# EAGLE design pactec_version_rev_A (EAGLE 6.6.0)
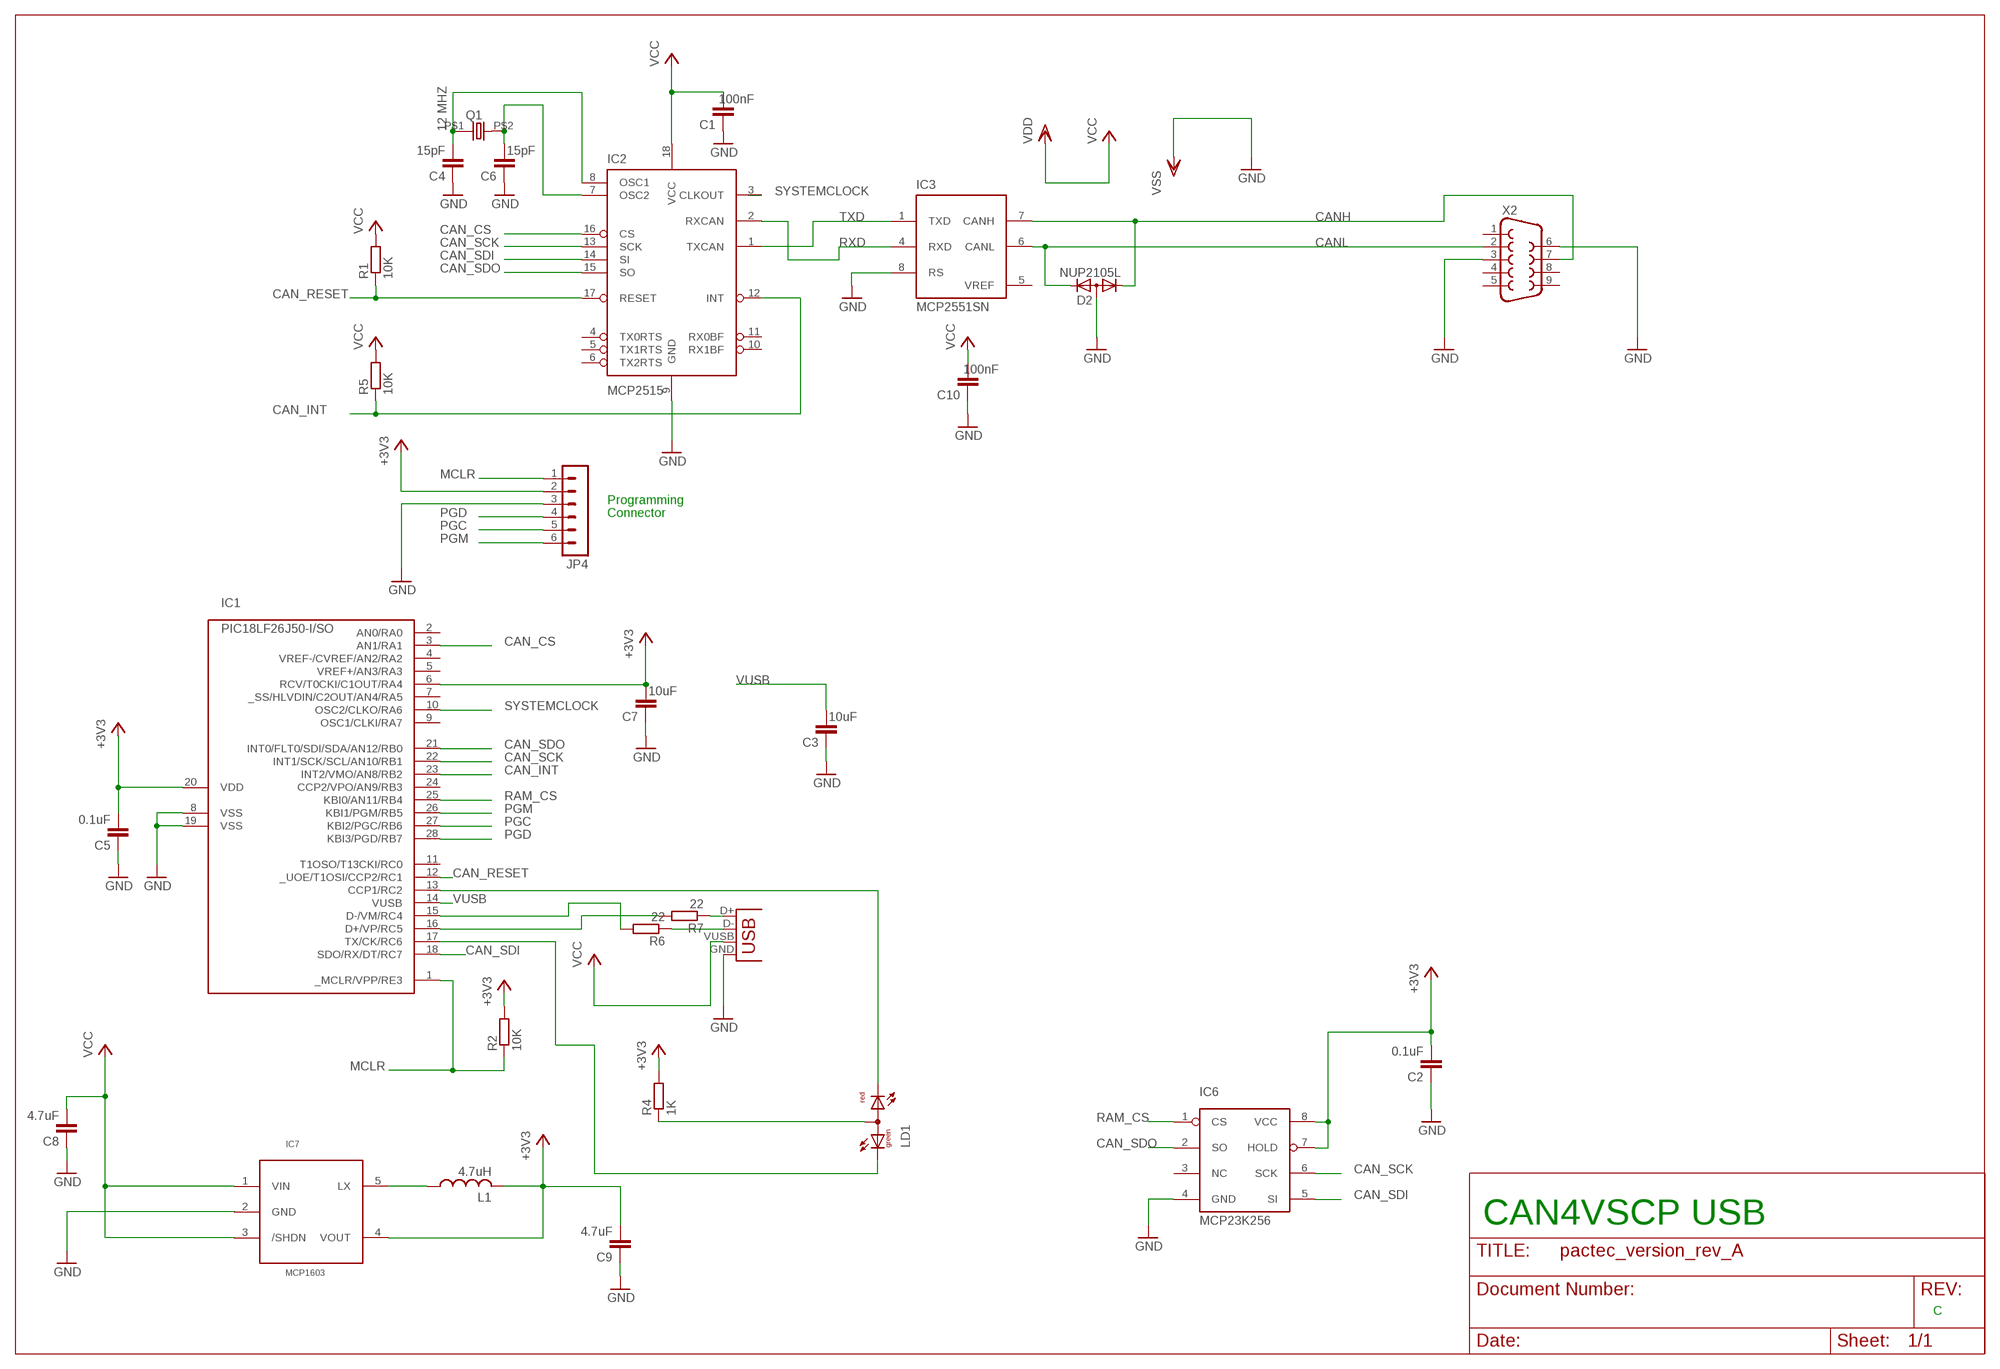
[diagram p0: schematic, sheet 1]

## Parts
C1  100nF  C-EUC0805  [C0805]
C2  0.1uF  C-EUC0805  [C0805]
C3  10uF  C-EUC0805  [C0805]
C4  15pF  C-EUC0805  [C0805]
C5  0.1uF  C-EUC0805  [C0805]
C6  15pF  C-EUC0805  [C0805]
C7  10uF  C-EUC0805  [C0805]
C8  4.7uF  C-EUC0805  [C0805]
C9  4.7uF  C-EUC0805  [C0805]
C10  100nF  C-EUC0805  [C0805]
D2  NUP2105L  DIODE-2CA|ACSOT23  [SOT23]
IC1  PIC18LF26J50-I/SO  PIC18LF2550-I/SO  [SO-28W]
IC2  MCP2515  [SO-18W]
IC3  MCP2551SN  [SO-08]
IC6  MCP23K256  MCP23A256  [SO-8]
IC7  MCP1603  [SOT23-5L]
J4  USB-B-S  [USB-B-SMT]
JP4  MA06-1  [MA06-1]
L1  4.7uH  L-USL2012C  [L2012C]
LD1  DUOLED-RG-A  [DUOLED-A-5MM]
Q1  12 MHZ  HC-49S  [9C]
R1  10K  R-EU_R0805  [R0805]
R2  10K  R-EU_R0805  [R0805]
R4  1K  R-EU_R0805  [R0805]
R5  10K  R-EU_R0805  [R0805]
R6  22  R-EU_R0805  [R0805]
R7  22  R-EU_R0805  [R0805]
X2  DB9MALE  [DB9_MALE]

## Nets
+3V3: C2.2 C5.2 C7.2 C9.2 IC1.6(RCV/T0CKI/C1OUT/RA4) IC1.20(VDD) IC6.7(HOLD) IC6.8(VCC) IC7.4(VOUT) JP4.2 L1.2 R2.2 R4.2
CAN_CS: IC1.3(AN1/RA1) IC2.16(CS)
CAN_INT: IC1.23(INT2/VMO/AN8/RB2) IC2.12(INT) R5.1
CAN_RESET: IC1.12(_UOE/T1OSI/CCP2/RC1) IC2.17(RESET) R1.1
CAN_SCK: IC1.22(INT1/SCK/SCL/AN10/RB1) IC2.13(SCK) IC6.6(SCK)
CAN_SDI: IC1.18(SDO/RX/DT/RC7) IC2.14(SI) IC6.5(SI)
CAN_SDO: IC1.21(INT0/FLT0/SDI/SDA/AN12/RB0) IC2.15(SO) IC6.2(SO)
CANH: D2.1(K1) IC3.7(CANH) X2.7
CANL: D2.2(K2) IC3.6(CANL) X2.2
GND: C1.1 C2.1 C3.1 C4.1 C5.1 C6.1 C7.1 C8.1 C9.1 C10.1 D2.3(A) IC1.8(VSS) IC1.19(VSS) IC2.9(GND) IC3.8(RS) IC6.4(GND) IC7.2(GND) J4.GND JP4.3 X2.3 X2.6 ; supply symbol labelled VSS
MCLR: IC1.1(_MCLR/VPP/RE3) JP4.1 R2.1
N$1: IC1.16(D+/VP/RC5) R7.2
N$2: C4.2 IC2.8(OSC1) Q1.P$1
N$3: IC1.15(D-/VM/RC4) R6.2
N$4: LD1.A R4.1
N$5: IC1.13(CCP1/RC2) LD1.CR
N$7: C6.2 IC2.7(OSC2) Q1.P$2
N$10: IC1.17(TX/CK/RC6) LD1.CX(CG)
N$13: J4.D- R6.1
N$14: J4.D+ R7.1
N$16: IC7.5(LX) L1.1
PGC: IC1.27(KBI2/PGC/RB6) JP4.5
PGD: IC1.28(KBI3/PGD/RB7) JP4.4
PGM: IC1.26(KBI1/PGM/RB5) JP4.6
RAM_CS: IC1.25(KBI0/AN11/RB4) IC6.1(CS)
RXD: IC2.2(RXCAN) IC3.4(RXD)
SYSTEMCLOCK: IC1.10(OSC2/CLKO/RA6) IC2.3(CLKOUT)
TXD: IC2.1(TXCAN) IC3.1(TXD)
VCC: C1.2 C8.2 C10.2 IC2.18(VCC) IC7.1(VIN) IC7.3(/SHDN) J4.VUSB(VBUS) R1.2 R5.2 ; supply symbol labelled VDD
VUSB: C3.2 IC1.14(VUSB)
Unconnected: IC1.2(AN0/RA0) IC1.4(VREF-/CVREF/AN2/RA2) IC1.5(VREF+/AN3/RA3) IC1.7(_SS/HLVDIN/C2OUT/AN4/RA5) IC1.9(OSC1/CLKI/RA7) IC1.11(T1OSO/T13CKI/RC0) IC1.24(CCP2/VPO/AN9/RB3) IC2.4(TX0RTS) IC2.5(TX1RTS) IC2.6(TX2RTS) IC2.10(RX1BF) IC2.11(RX0BF) IC6.3(NC) X2.1 X2.4 X2.5 X2.8 X2.9

## Notes on the sheet
- Programming
- Connector
- CAN4VSCP USB
- C

## Power pins joined to a net without a drawn wire
GND: IC3.2(VSS)
VCC: IC3.3(VDD)
VREF: IC3.5(VREF)

## Library data of the parts
C1-C10 = rcl:C-EU: CAPACITOR, European symbol
D2 = diode:DIODE-2CA|AC: Dual DIODE Cathode-Anode|Anode-Cathode
IC1 = microchip-pic18fxx5x:PIC18*2550: PIC18*2550 Microchip FLASH Microcontroller with FS-USB DEVICE FEATURES Feature PIC18*2550 Program Memory (bytes) 32k Program Memory (instructions) 16384 I/O Ports Ports A, B, C, (E) Capture/Compare/PWM Modules 2 Enhanced Capture/Compare/PWM Modules 0 Parallel Communications (PSP) No 10-bit Analog-to-Digital Module 10 input Channels Package Types 28-pin PDIP 28-pin SOIC NOTES: F only after 18, means standard voltage range from 4.2v to 5.5v LF after 18, means extended voltage range from 2.0v to 5.5v T after entire device number, means supplied in tape and reel TQFP packages only -E before / denotes extended temperature range from -40°C to +120°C -I before / denotes industrial temperature range from -40°C to +85°C /PT suffix denotes TQFP package /SO suffix denotes SOIC package /SP suffix denotes Skinny Plastic DIP package /P suffix denotes Plastic DIP package /ML suffix denotes QFN package
IC2 = vscpcan:MCP2515
IC3 = microchip_can:MCP2551: High Speed CAN tranceiver
IC6 = vscpcan:MCP23A256
IC7 = eurosource_mcp1603:MCP1603
J4 = con-usb:USB: USB Connectors
JP4 = con-lstb:MA06-1: PIN HEADER; OC_FARNELL: unknown; OC_NEWARK: unknown
L1 = rcl:L-US: INDUCTOR, American symbol
LD1 = led:DUOLED-RG-A: DUO LED 2 colors (red/green), 5 mm, round, common Anode www.ligitek.com or other producers.
Q1 = vscpcan:HC-49S: Digikey 887-1050-1-nd
R1 R2 R4-R7 = rcl:R-EU_: RESISTOR, European symbol
X2 = SparkFun-Connectors:DB9: DB9 Connector Standard DB9 (D-Sub 9) serial connector. Can be used for CAN bus as well as RS485 and RS232. Footprint production proven. Spark Fun Electronics SKU : PRT-00429

## Board
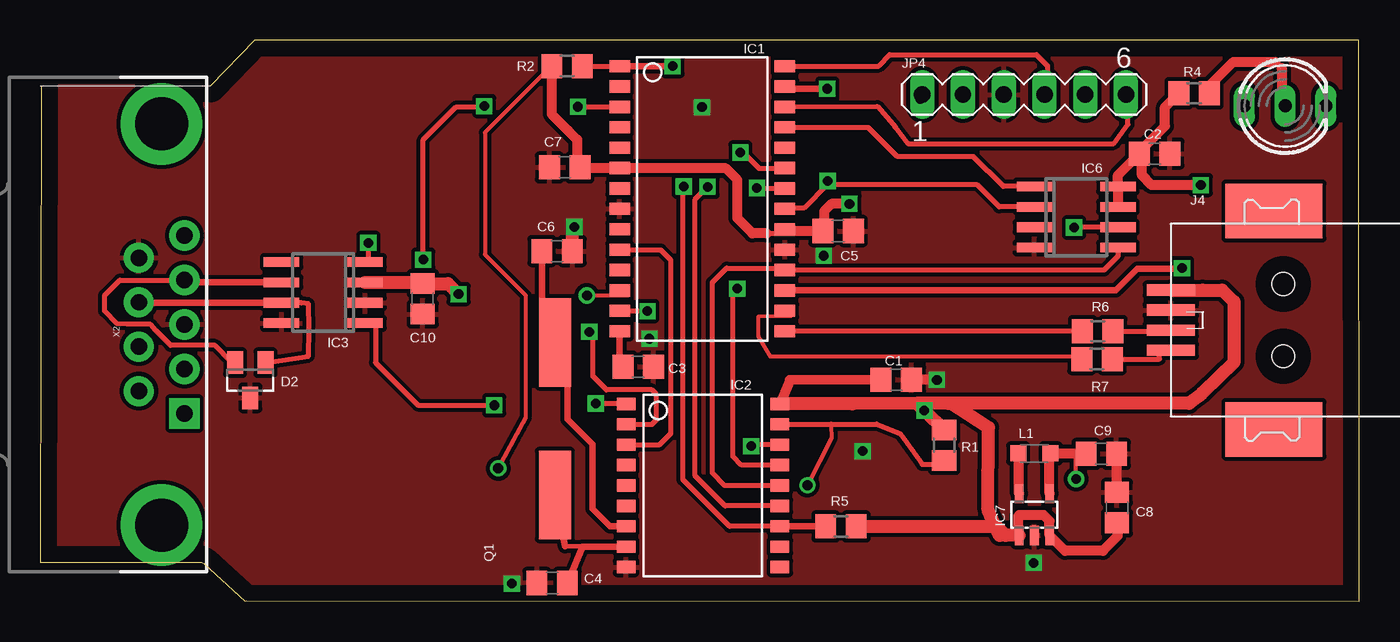
[diagram p1: board, top side]
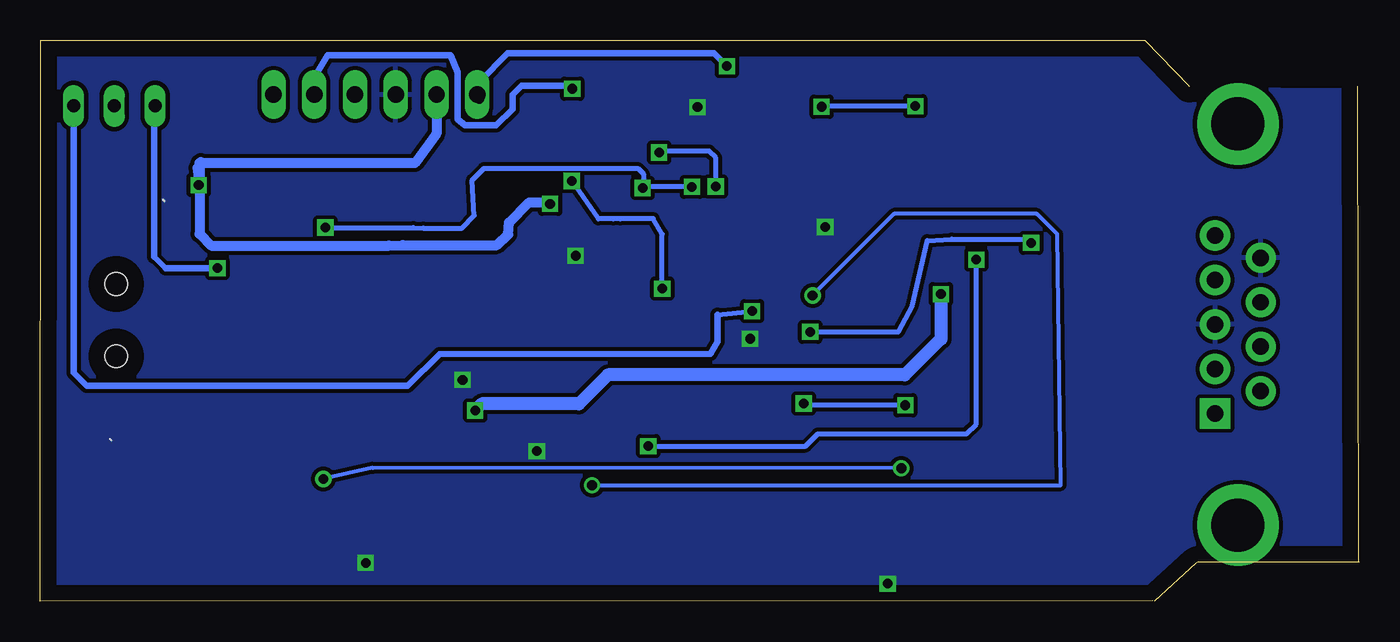
[diagram p2: board, bottom side, seen from below]

Size 82.2 x 34.96 mm. Coordinates in mm from the lower left corner, seen from the top.
Outline: 12.87,0.03 82.2,0 82.16,34.95 13.37,34.95
Outline: 13.36,34.96 10.59,32.08
Outline: 0,2.43 10.08,2.43 10.18,2.37 12.78,0.01
Outline: 0.05,2.44 0.09,32.09
Copper layers (1*16): Top 0.035mm / dielectric 1.5mm / Bottom 0.035mm
Design rules "10mils": minimum track width 10mil, minimum drill 24mil, track to track 10mil, track to pad 10mil, pad to pad 10mil, via to via 10mil, smd to smd 10mil, copper to edge 40mil, drill to drill 10mil, minimum pad ring 10mil, minimum via ring 8mil, stop-mask expansion 0mil, vias tented up to drill 0mil, thermal gap 10mil

### Footprints (pad centres in the part's own frame; a part is rotated, then mirrored left to right if it is on the bottom)
C0805 = smd 1.3 x 1.5: 1 -0.95,0; 2 0.95,0
SOT23 = smd 1 x 1.4: 1 -0.95,-1.1; 2 0.95,-1.1; 3 0,1.1
SO-28W = smd 0.762 x 1.27: 1 -7.62,-5.207; 2 -6.35,-5.207; 3 -5.08,-5.207; 4 -3.81,-5.207; 5 -2.54,-5.207; 6 -1.27,-5.207; 7 0,-5.207; 8 1.27,-5.207; 9 2.54,-5.207; 10 3.81,-5.207; 11 5.08,-5.207; 12 6.35,-5.207; 13 7.62,-5.207; 14 8.89,-5.207; 15 8.89,5.08; 16 7.62,5.08; 17 6.35,5.08; 18 5.08,5.08; 19 3.81,5.08; 20 2.54,5.08; 21 1.27,5.08; 22 0,5.08; 23 -1.27,5.08; 24 -2.54,5.08; 25 -3.81,5.08; 26 -5.08,5.08; 27 -6.35,5.08; 28 -7.62,5.08
SO-18W = smd 0.762 x 1.143: 1 -5.08,-4.788; 2 -3.81,-4.788; 3 -2.54,-4.788; 4 -1.27,-4.788; 5 0,-4.788; 6 1.27,-4.788; 7 2.54,-4.788; 8 3.81,-4.788; 9 5.08,-4.788; 10 5.08,4.788; 11 3.81,4.788; 12 2.54,4.788; 13 1.27,4.788; 14 0,4.788; 15 -1.27,4.788; 16 -2.54,4.788; 17 -3.81,4.788; 18 -5.08,4.788
SO-08 = smd 0.6 x 2.2: 1 -1.905,-2.6; 2 -0.635,-2.6; 3 0.635,-2.6; 4 1.905,-2.6; 5 1.905,2.6; 6 0.635,2.6; 7 -0.635,2.6; 8 -1.905,2.6
SO-8 = smd 0.6 x 2.2: 1 -1.905,-2.6; 2 -0.635,-2.6; 3 0.635,-2.6; 4 1.905,-2.6; 5 1.905,2.6; 6 0.635,2.6; 7 -0.635,2.6; 8 -1.905,2.6
SOT23-5L = smd 0.55 x 1.2: 1 -0.95,-1.3; 2 0,-1.3; 3 0.95,-1.3; 4 0.95,1.3; 5 -0.95,1.3
USB-B-SMT = smd 6.04 x 3.4: 5 0.58,6.8; 6 0.58,-6.8 | smd 3 x 0.7: D+ 7,1.875; D- 7,0.625; GND 7,-0.625; VUSB 7,-1.875 | hole 1.4: 0,2.25; 0,-2.25
MA06-1 = drill 1.016 long: 1 -6.35,0; 2 -3.81,0; 3 -1.27,0; 4 1.27,0; 5 3.81,0; 6 6.35,0
L2012C = smd 1 x 1: 1 -1,0; 2 1,0
DUOLED-A-5MM = drill 0.813 long: A 0,0; CR 2.54,0; CX -2.54,0
9C = smd 5.5 x 2: P$1 -4.74,0; P$2 4.76,0
R0805 = smd 1.3 x 1.5: 1 -0.95,0; 2 0.95,0
DB9_MALE = drill 1.016 pad 1.88: 1 5.54,-1.42; 2 2.77,-1.42; 3 0,-1.42; 4 -2.77,-1.42; 6 4.15,1.42; 7 1.38,1.42; 8 -1.38,1.42; 9 -4.15,1.42 | drill 1.016 pad 1.88 square: 5 -5.54,-1.42 | drill 3.302 pad 5.08: G1 -12.5,0; G2 12.5,0

### Placement (x,y rotation side)
C1  53.35,13.81 180 top
C2  69.45,27.89 180 top
C3  37.26,14.62 180 top
C4  31.9,1.15 0 top
C5  49.72,23.07 180 top
C6  32.21,21.82 180 top
C7  32.68,27.04 0 top
C8  67.1,5.84 270 top
C9  66.12,9.19 180 top
C10  23.84,18.85 90 top
D2  13.09,13.78 180 top
IC1  41.32,25.72 270 top
IC2  41.3,7.22 270 top
IC3  17.64,19.24 90 top
IC6  64.56,23.94 270 top
IC7  61.95,5.41 0 top
J4  77.45,17.52 180 top
JP4  61.31,31.57 0 top
L1  61.95,9.22 0 top
LD1  77.58,30.86 0 top
Q1  32.08,11.37 90 top
R1  56.33,9.73 90 top
R2  32.83,33.34 180 top
R4  71.9,31.65 180 top
R5  49.9,4.67 0 top
R6  65.9,16.83 180 top
R7  65.85,15.09 180 top
X2  7.57,17.25 90 top

### Tracks (layer width: path | path; a pad name or v marks a point on that pad's centre or on a via)
+3V3  (via drill 0.6, 0.61)
  Top 0.254: 45.28,22.93 45.5,22.87 46.77,22.87 IC1.20 | v64.55,7.63 64.55,8.9 C9.2 | v28.54,8.29 30.26,11.44 30.26,19.06 27.72,21.6 27.72,29.22 31.53,33.03 R2.2 | C7.2 33.43,27.13 33.33,28.75 32.8,29.22 32.91,29.33
  Top 0.305: 36.09,26.97 IC1.6 | 45.28,22.93 46.15,22.93
  Top 0.406: 33.7,26.97 C7.2
  Top 0.61: IC1.20 46.51,23.07 C5.2 48.85,23.15 48.85,24.3 49.31,24.76 v50.43,24.76 | 36.09,26.97 33.7,26.97 | 45.28,22.93 44.38,22.93 43.44,23.87 43.44,26.26 42.73,26.97 36.13,26.97 IC1.6 | R2.2 31.88,30.35 32.91,29.33 33.47,28.76 33.47,27.2 | IC7.4 62.9,9.17 L1.2 65.14,9.22 C9.2 | IC6.7 IC6.8 67.16,26.55 C2.2 | C2.2 68.5,28.01 70.09,29.6 70.09,30.79 R4.2 | v72.32,25.93 69.25,25.93 68.65,26.53 68.65,27.74 C2.2
  Bottom 0.254: v64.55,7.63 61.47,8.32 v28.54,8.29 | 53.12,22.87 53.03,22.87
  Bottom 0.61: JP4.2 57.5,29.14 58.84,27.3 72.27,27.3 | 72.27,27.3 72.19,27.37 72.2,27.14 72.39,26.99 v72.32,25.93 | 72.27,27.3 72.27,22.9 71.53,22.16 60.47,22.16 59.6,22.19 53.74,22.19 53.03,22.85 53.03,22.87 52.99,23.6 51.73,24.86 50.53,24.86 v50.43,24.76
CAN_CS  (via drill 0.6)
  Top 0.305: IC2.16 44.4,9.76 v44.31,9.67 | v23.87,21.29 23.87,28.75 25.93,30.81 27.63,30.81 v27.67,30.85 | v33.51,30.81 IC1.3
  Bottom 0.305: v44.31,9.67 34.5,9.67 33.74,10.43 24.49,10.43 23.87,11.05 v23.87,21.29 | v27.67,30.85 33.47,30.85 v33.51,30.81
CAN_INT  (via drill 0.6)
  Top 0.305: R5.1 | IC2.12 42.96,4.68 40.05,7.59 40.05,25.79 v40.1,25.84 | v43.63,27.96 43.81,27.96 44.8,26.97 46.38,26.97 IC1.23
  Top 0.406: IC2.12 R5.1
  Bottom 0.305: v40.1,25.84 40.1,27.63 40.52,28.05 43.54,28.05 v43.63,27.96
CAN_RESET  (via drill 0.61)
  Top 0.254: v34.07,19.06 36.61,19.06 IC1.12 | v47.81,7.24 49.31,10.17 49.26,10.98 49.28,11.04
  Top 0.305: IC2.17 49.28,11.04 52.13,11.04 53.61,10.44 54.97,8.54 56,8.54
  Top 0.61: 56,8.54 56.15,8.6 R1.1
  Bottom 0.254: v34.07,19.06 28.99,24.14 20.1,24.14 18.83,22.87 18.6,7.24 v47.81,7.24
CAN_SCK  (via drill 0.6)
  Top 0.305: IC2.13 42.68,5.95 40.81,7.82 40.81,25.04 v41.59,25.82 | v44.66,25.75 46.37,25.75 IC1.22 | IC6.6 64.45,23.31 v64.43,23.29
  Bottom 0.305: v41.59,25.82 44.59,25.82 v44.66,25.75 44.61,25.8 44.61,26.63 44.95,26.97 54.55,26.97 55.28,26.24 55.16,24.03 55.9,23.25 58.33,23.25 58.95,23.29 v64.43,23.29
CAN_SDI
  Top 0.305: IC2.14 42.67,7.22 41.88,8.01 41.88,19.87 42.77,20.76 46.28,20.76 IC1.18 66.29,20.64 67.16,21.51 IC6.5
CAN_SDO  (via drill 0.6)
  Top 0.305: IC2.15 43.71,8.49 43.17,9.03 43.17,19.21 v43.44,19.48 | IC1.21 46.44,24.49 47.58,24.49 49.07,25.98 v49.07,26.19 49.31,25.95 58.39,25.95 59.77,24.58 IC6.2
  Bottom 0.305: v43.44,19.48 43.44,22.88 44,23.85 46.05,23.82 46.48,23.83 47.41,23.83 v49.07,26.19
CANH
  Top 0.305: D2.1 16.73,15.28 16.76,16.96 16.72,18.54 16.27,18.6 IC3.7
  Top 0.406: IC3.7 6.17,18.61
  Top 0.61: 6.17,18.61 X2.7
CANL
  Top 0.305: D2.2 11.97,14.88 10.9,15.95 8.13,15.95 7.23,16.85 6.88,17.25 5.41,17.27 4.8,17.3 4.01,18.09 4.01,19.06 4.97,20.02 X2.2
  Top 0.406: IC3.6 9.13,19.88
  Top 0.61: 9.13,19.88 X2.2
GND  (via drill 0.6)
  Top 0.254: 55.66,13.98 v55.88,13.8
  Top 0.61: C8.1 67.1,9.16 C9.1 | v55.88,13.8 C1.1
  Top 0.813: C6.1 33.16,23.2 v33.28,23.32
  other vias: 61.91,2.4 29.39,1.11 51.25,9.36 41.24,30.79 48.83,21.53 37.96,16.36
  pour Top: 11.27,32.05 -1.61,32.05 -1.61,31.52 -1.62,2.13 10.27,2.29 12.52,0.28 82.09,0.3 81.8,34.57 13.59,34.53
  pour Bottom: -1.29,31.85 -1.5,2.1 10.18,2.28 12.92,0.24 81.69,-0.02 81.85,34.61 13.48,34.43 11.13,31.9
MCLR  (via drill 0.6)
  Top 0.305: JP4.1 54.96,31.43 v54.83,31.3 | R2.1 IC1.1
  Top 0.406: v39.41,33.34 IC1.1
  Bottom 0.406: v54.83,31.3 54.83,32.38 53.06,34.15 40.22,34.15 v39.41,33.34
N$1
  Top 0.254: IC1.16 46.77,17.79 44.77,17.76 44.77,16.49 45.5,15.25 64.55,15.25 R7.2
N$2
  Top 0.305: 33.79,3.41 32.7,3.44
  Top 0.406: IC2.8 33.79,3.41 C4.2 | 32.7,3.44 Q1.P$1
N$3
  Top 0.305: R6.2 IC1.15
N$4
  Top 0.305: R4.1 72.85,32.11 | 76.98,33.61 77.36,33.23
  Top 0.61: 72.85,32.11 74.35,33.61 76.98,33.61 | 77.36,33.23 77.36,31.08 LD1.A
N$5  (via drill 0.6)
  Top 0.305: v37.84,18.08 36.13,18.08 IC1.13
  Bottom 0.305: 40,17.86 v37.84,18.08
  Bottom 0.406: LD1.CR 80.12,14.25 79.29,13.42 59.3,13.42 57.32,15.4 40.43,15.42 40,16.17 40,17.86
N$7
  Top 0.305: 32.85,15.36 Q1.P$2 31.26,16.95
  Top 0.406: IC2.7 35.5,4.68 34.41,5.77 34.41,9.78 32.85,11.34 32.85,15.36 | C6.2 31.26,16.95
N$10  (via drill 0.6)
  Top 0.305: 71.1,20.71 v71.15,20.76
  Top 0.406: IC1.17 67.04,19.37 68.38,20.71 71.1,20.71
  Bottom 0.305: 74.39,20.76 75.1,21.47 | 75.1,30.8 LD1.CX
  Bottom 0.406: v71.15,20.76 74.39,20.76 | 75.1,21.47 75.1,30.8
N$13
  Top 0.305: R6.1 70.45,16.83 J4.D-
N$14
  Top 0.305: R7.1 69.75,15.09 69.75,15.58 70.45,15.58 J4.D+
N$16
  Top 0.61: IC7.5 61,9.17 L1.1
PGC  (via drill 0.6)
  Top 0.406: v49.04,31.93 46.54,31.93 IC1.27
  Bottom 0.406: JP4.5 65.12,32.62 64.28,34.02 56.61,34.02 56.19,32.95 56.19,30.02 55.73,29.65 53.78,29.65 52.76,30.67 52.76,31.56 52.2,32.12 49.23,32.12 v49.04,31.93
PGD
  Top 0.305: IC1.28 52.26,33.34 52.94,34.06 62.09,34.06 62.77,33.38 62.77,31.76
  Top 0.61: 62.77,31.76 JP4.4
PGM
  Top 0.305: IC1.26 52.17,30.83 53.31,29.49 53.26,29.57 54.08,28.52 66.89,28.52 67.78,29.72 67.78,31.45
  Top 0.61: 67.78,31.45 JP4.6
RAM_CS
  Top 0.305: IC6.1 60.02,25.85 58.16,27.7 53.42,27.7 51.61,29.51 46.42,29.51 IC1.25
RXD  (via drill 0.6)
  Top 0.305: IC2.2 38.12,11.03 38.4,11.31 38.4,12.9 38.12,13.18 35.29,13.18 34.45,14.02 34.45,16.56 v34.22,16.79 | v20.45,22.33 20.45,21.36 IC3.4
  Bottom 0.305: v34.22,16.79 28.73,16.79 27.86,18.43 26.92,22.47 25.41,22.56 20.68,22.56 v20.45,22.33
SYSTEMCLOCK
  Top 0.305: IC2.3 38.6,9.76 39.3,10.46 39.3,21.26 38.68,21.88 36.14,21.88 IC1.10
TXD  (via drill 0.6)
  Top 0.305: IC3.1 20.76,17.34 20.9,17.19 20.9,14.87 23.55,12.22 v28.29,12.22 | v34.62,12.33 36.48,12.33 IC2.1
  Bottom 0.305: v28.29,12.22 34.51,12.22 v34.62,12.33
VCC  (via drill 0.6)
  Top 0.305: 72.56,19.54 72.42,19.4
  Top 0.61: 60.16,4.11 59.78,4.11 | 56.7,12.36 56.58,12.34 56.8,12.33 | 72.43,13.02 72.4,12.98 | IC7.1 60.93,4.18 60.93,5.3 61.01,5.38 62.54,5.38 62.9,5.02 IC7.3 63.86,3.15 66.22,3.15 67.13,4.06 C8.2 | 54.77,12.21 54.6,12.34 | C1.2 46.71,13.78 IC2.18
  Top 0.813: IC7.1 60.16,4.11 59.6,4.67 R5.2 | 59.78,4.11 59.06,5.7 59.09,10.83 56.7,12.36 | 56.58,12.34 54.6,12.34 50.6,12.31 IC2.18 | J4.VUSB 72.42,19.4 73.66,19.4 74.38,18.67 74.38,14.91 72.43,13.02 | 72.4,12.98 71.58,12.33 56.8,12.33 | R1.2 55.19,11.8 | 55.19,11.8 v55.09,11.89 | v55.09,11.89 54.77,12.21 | IC3.3 23.77,19.88 C10.2 25.41,19.8 v26.07,19.14 | v55.09,11.89 55.19,11.8
  Bottom 0.813: v26.07,19.14 26.07,16.36 28.32,14.11 46.83,14.11 48.63,12.31 54.68,12.31 v55.09,11.89
VUSB
  Top 0.406: IC1.14 36.11,14.82 C3.2